# Altium schematic sheet OSCILLAR_HFB_V1p0_LFFILTB.SchDoc
size A4; SheetNumber: 8; SheetTotal: 12; Title_: Low freq. Filter Bank
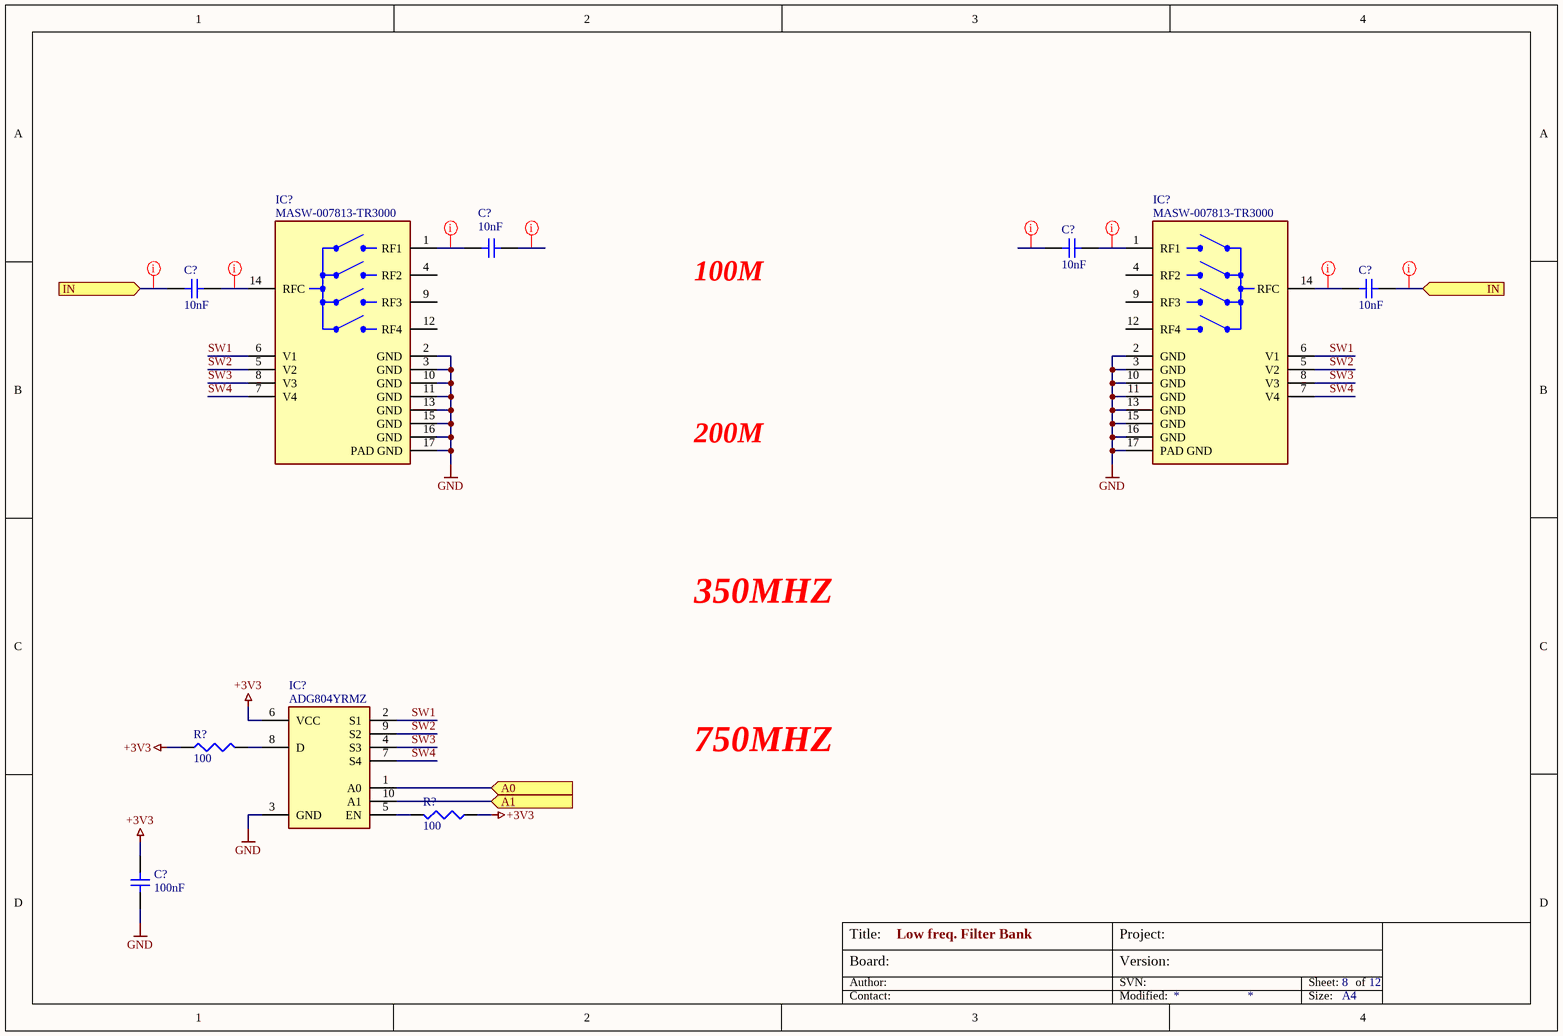
[diagram p0: OSCILLAR_HFB_V1p0_LFFILTB.SchDoc]

## Parts
(Parts that share a designator on the sheet are numbered #1, #2 ... from top to bottom, then left to right.)
C?#1  10nF  [CAP_0603]
C?#2  10nF  [CAP_0603]
C?#3  10nF  [CAP_0603]
C?#4  10nF  [CAP_0603]
C?#5  100nF  [CAP_0603]
IC?#1  MASW-007813-TR3000  [QFN-16]
IC?#2  MASW-007813-TR3000  [QFN-16]
IC?#3  ADG804YRMZ  [MSOP-10]
R?#1  100  [RES-0603]
R?#2  100  [RES-0603]

## Ports
A0 (in), A1 (in), IN (in, see OSCILLAR_HFB_V1p0_MAIN)

## Nets
+3V3: C?#5.2 IC?#3.6(VCC) R?#1.1 R?#2.1
GND: C?#5.1 IC?#1.2(GND) IC?#1.3(GND) IC?#1.10(GND) IC?#1.11(GND) IC?#1.13(GND) IC?#1.15(GND) IC?#1.16(GND) IC?#1.17(PAD_GND) IC?#2.2(GND) IC?#2.3(GND) IC?#2.10(GND) IC?#2.11(GND) IC?#2.13(GND) IC?#2.15(GND) IC?#2.16(GND) IC?#2.17(PAD_GND) IC?#3.3(GND)
A0: IC?#3.1(A0) ; port A0
A1: IC?#3.10(A1) ; port A1
IN: C?#3.2 C?#4.2 ; port IN
SW1: IC?#1.6(V1) IC?#2.6(V1) IC?#3.2(S1)
SW2: IC?#1.5(V2) IC?#2.5(V2) IC?#3.9(S2)
SW3: IC?#1.8(V3) IC?#2.8(V3) IC?#3.4(S3)
SW4: IC?#1.7(V4) IC?#2.7(V4) IC?#3.7(S4)
NetC?#1_2: C?#1.2 IC?#1.1(RF1)
NetC?#2_2: C?#2.2 IC?#2.1(RF1)
NetC?#3_1: C?#3.1 IC?#1.14(RFC)
NetC?#4_1: C?#4.1 IC?#2.14(RFC)
NetIC?#3_5: IC?#3.5(EN) R?#2.2
NetIC?#3_8: IC?#3.8(D) R?#1.2

Not connected (* = marked no-connect by the designer): C?#1 1; C?#2 1; IC?#1 4(RF2) 9(RF3) 12(RF4); IC?#2 4(RF2) 9(RF3) 12(RF4)

## Layout directives
net class 50R: IN, NetC?#1_1, NetC?#1_2, NetC?#2_1, NetC?#2_2, NetC?#3_1, NetC?#4_1

## Notes on the sheet
- 100M
- 200M
- 350MHZ
- 750MHZ
- Board:
- Author:
- Title:
- Project:
- SVN:
- Version:
- Sheet:
- of
- Contact:
- Modified:
- Size:
- A4

## Library data of the parts
C?#1-C?#5 = NP-CAPACITOR: MLCC capacitor; Type: CAP
IC?#1 IC?#2 = MASW-007813-TR3000: RF Switch, SP4T, DC-3GHz; Part number: 937-MASW007813TR3; Supplier: Mouser; Type: IC; ComponentLink1Description: Datasheet; ComponentLink2Description: Order; ComponentLink2URL: https://eu.mouser.com/ProductDetail/MACOM/MASW-007813-TR3000?qs=zQS7eqYV0KQlMvot4Elvtw%3D%3D
IC?#3 = ADG804YRMZ: Multiplexer Switch ICs 4-Channel,Low Voltage Multiplexer IC.; Part number: 584-ADG804YRMZ-R7; Type: IC; Supplier: Mouser; ComponentLink1Description: Datasheet; ComponentLink1URL: ADG804-1502993.pdf; ComponentLink2Description: Order; ComponentLink2URL: https://hu.mouser.com/ProductDetail/Analog-Devices/ADG804YRMZ-REEL7?qs=BpaRKvA4VqFEf8QtrI%2FU8w%3D%3D
R?#1 R?#2 = RESISTOR: Metal Film Resistor; Type: RES